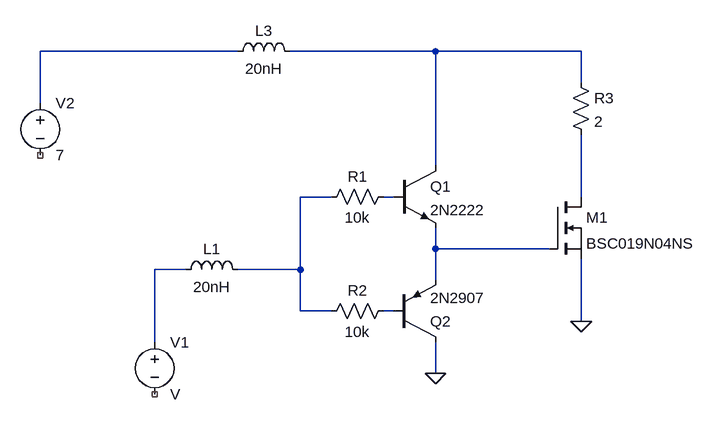
[diagram p0: schematic Draft2.asc]
Draft2.asc, the LTspice schematic file:
Version 4.1
SHEET 1 880 1460
WIRE -3680 -512 -3984 -512
WIRE -3376 -512 -3600 -512
WIRE -3152 -512 -3376 -512
WIRE -3152 -464 -3152 -512
WIRE -3984 -432 -3984 -512
WIRE -3376 -336 -3376 -512
WIRE -3536 -288 -3584 -288
WIRE -3440 -288 -3456 -288
WIRE -3152 -288 -3152 -384
WIRE -3376 -208 -3376 -240
WIRE -3200 -208 -3376 -208
WIRE -3760 -176 -3808 -176
WIRE -3584 -176 -3584 -288
WIRE -3584 -176 -3680 -176
WIRE -3376 -160 -3376 -208
WIRE -3584 -112 -3584 -176
WIRE -3536 -112 -3584 -112
WIRE -3440 -112 -3456 -112
WIRE -3152 -96 -3152 -192
WIRE -3808 -64 -3808 -176
WIRE -3376 -16 -3376 -64
FLAG -3152 -96 0
FLAG -3376 -16 0
SYMBOL voltage -3808 -80 R0
SYMATTR InstName V1
SYMBOL res -3440 -304 R90
WINDOW 0 0 56 VBottom 2
WINDOW 3 32 56 VTop 2
SYMATTR InstName R1
SYMATTR Value 10k
SYMBOL res -3440 -128 R90
WINDOW 0 0 56 VBottom 2
WINDOW 3 32 56 VTop 2
SYMATTR InstName R2
SYMATTR Value 10k
SYMBOL npn -3440 -336 R0
SYMATTR InstName Q1
SYMATTR Value 2N2222
SYMBOL pnp -3440 -64 M180
SYMATTR InstName Q2
SYMATTR Value 2N2907
SYMBOL nmos -3200 -288 R0
SYMATTR InstName M1
SYMATTR Value BSC019N04NS
SYMBOL res -3168 -480 R0
SYMATTR InstName R3
SYMATTR Value 2
SYMBOL ind -3776 -160 R270
WINDOW 0 32 56 VTop 2
WINDOW 3 5 56 VBottom 2
SYMATTR InstName L1
SYMATTR Value 20nH
SYMATTR SpiceLine Rser=40m Cpar=50pF
SYMBOL voltage -3984 -448 R0
WINDOW 123 0 0 Left 0
WINDOW 39 0 0 Left 0
SYMATTR InstName V2
SYMATTR Value 7
SYMBOL ind -3696 -496 R270
WINDOW 0 32 56 VTop 2
WINDOW 3 5 56 VBottom 2
SYMATTR InstName L3
SYMATTR Value 20nH
SYMATTR SpiceLine Rser=40m Cpar=50pF

The netlist it stands for:
* Draft2.asc
V1 N007 NC_01 V
R1 N004 N003 10k
R2 N008 N003 10k
Q1 N002 N004 N006 0 2N2222
Q2 0 N008 N006 0 2N2907
M1 N005 N006 0 0 BSC019N04NS
R3 N002 N005 2
L1 N007 N003 20nH Rser=40m Cpar=50pF
V2 N001 NC_02 7
L3 N001 N002 20nH Rser=40m Cpar=50pF
.model NPN NPN
.model PNP PNP
.lib standard.bjt
.model NMOS NMOS
.model PMOS PMOS
.lib standard.mos
.backanno
.end